# Altium schematic sheet currentV_cond.SchDoc
size A4; SheetNumber: 3; SheetTotal: 12; SPICEModelCacheJNOYGZHY: <root> / <DocumentId>JNOYGZHY</DocumentId> / </root>
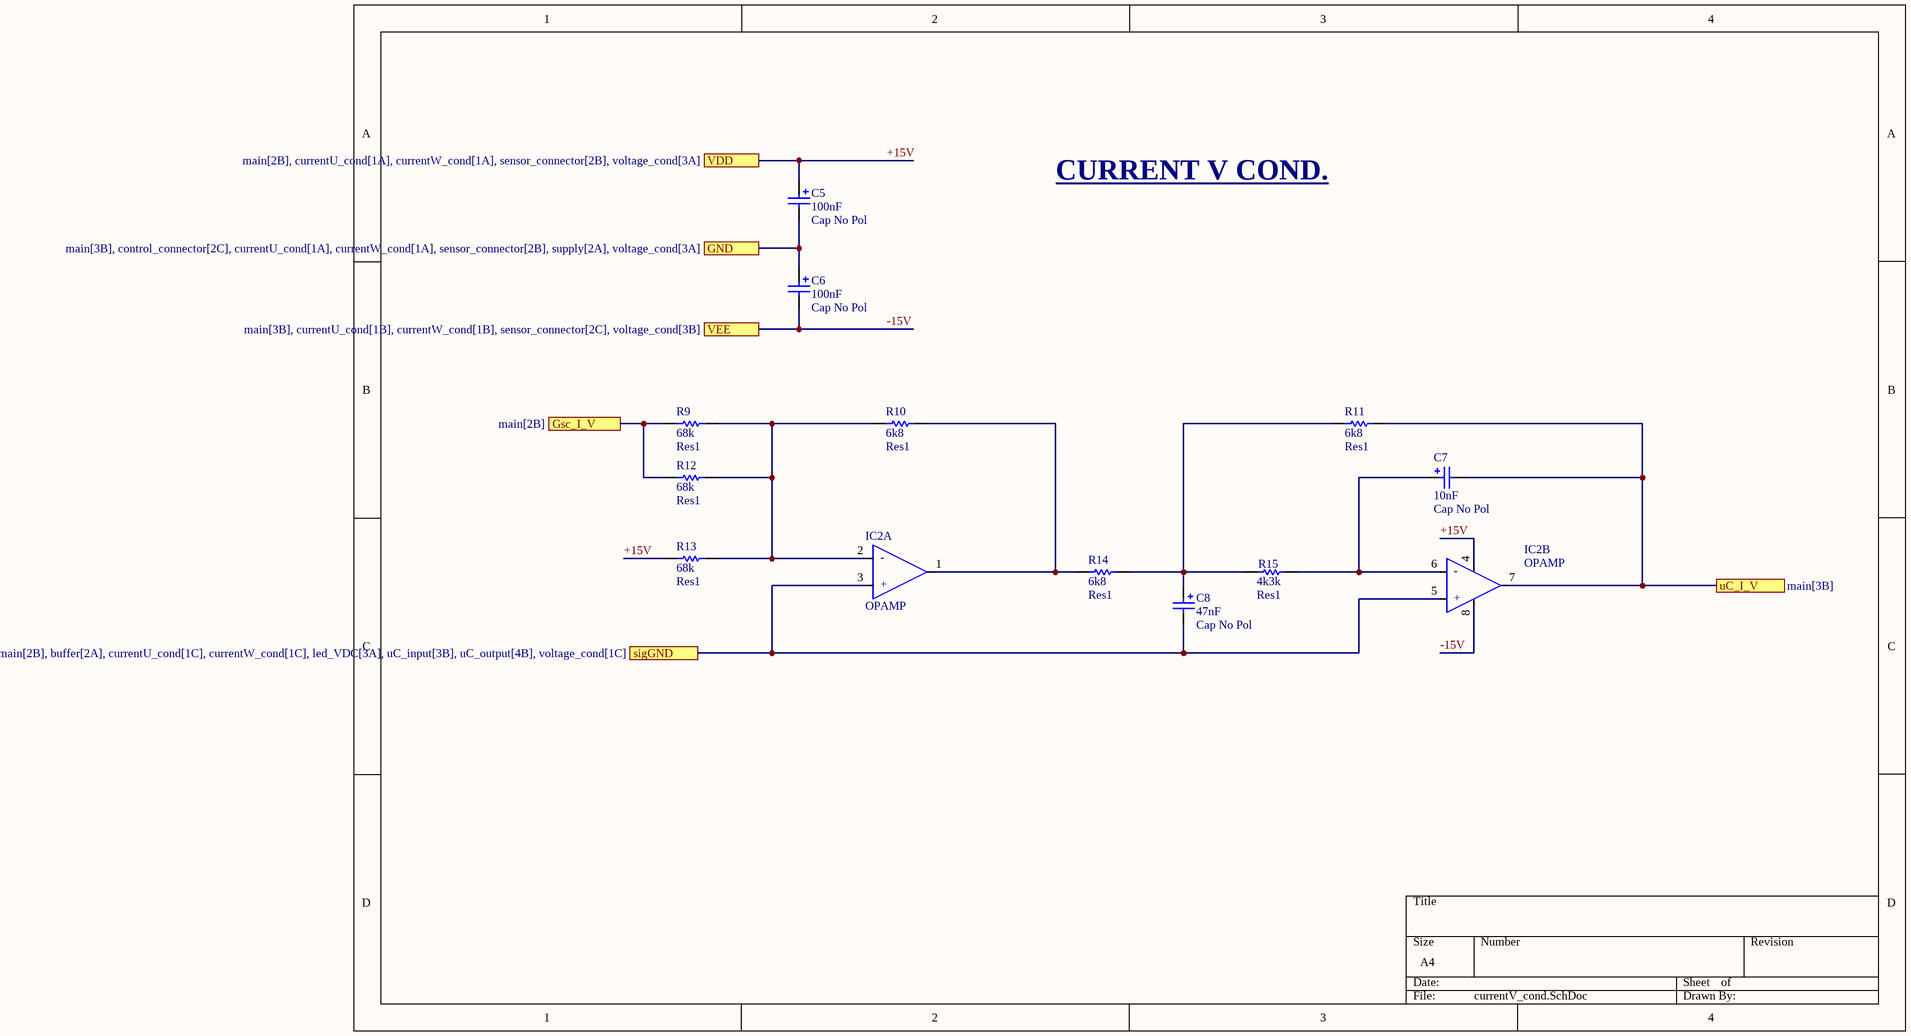
[diagram p0: currentV_cond.SchDoc]

## Parts
C5  Cap No Pol  value 100nF  [RAD-0.1_mod]
C6  Cap No Pol  value 100nF  [RAD-0.1_mod]
C7  Cap No Pol  value 10nF  [RAD-0.1_mod]
C8  Cap No Pol  value 47nF  [RAD-0.1_mod]
IC2  OPAMP  [DIP-8_mod]  (parts A,B of 2)
R9  Res1  value 68k  [AXIAL-0.3_mod]
R10  Res1  value 6k8  [AXIAL-0.3_mod]
R11  Res1  value 6k8  [AXIAL-0.3_mod]
R12  Res1  value 68k  [AXIAL-0.3_mod]
R13  Res1  value 68k  [AXIAL-0.3_mod]
R14  Res1  value 6k8  [AXIAL-0.3_mod]
R15  Res1  value 4k3k  [AXIAL-0.3_mod]

## Ports
GND (see main[3B], control_connector[2C], currentU_cond[1A], currentW_cond[1A], sensor_connector[2B], supply[2A], voltage_cond[3A]), Gsc_I_V (see main[2B]), sigGND (see main[2B], buffer[2A], currentU_cond[1C], currentW_cond[1C], led_VDC[3A], uC_input[3B], uC_output[4B], voltage_cond[1C]), uC_I_V (see main[3B]), VDD (see main[2B], currentU_cond[1A], currentW_cond[1A], sensor_connector[2B], voltage_cond[3A]), VEE (see main[3B], currentU_cond[1B], currentW_cond[1B], sensor_connector[2C], voltage_cond[3B])

## Nets
+15V: C5.1 IC2.4(-V) R13.1 ; port VDD
-15V: C6.2 IC2.8(V+) ; port VEE
GND: C5.2 C6.1 ; port GND
Gsc_I_V: R9.1 R12.1 ; port Gsc_I_V
sigGND: C8.2 IC2.3(IN_A_+) IC2.5(IN_B_+) ; port sigGND
uC_I_V: C7.2 IC2.7(OUT_B) R11.2 ; port uC_I_V
NetC7_1: C7.1 IC2.6(IN_B_-) R15.2
NetC8_1: C8.1 R11.1 R14.2 R15.1
NetIC2_1: IC2.1(OUT_A) R10.2 R14.1
NetIC2_2: IC2.2(IN_A_-) R9.2 R10.1 R12.2 R13.2

## Notes on the sheet
- CURRENT V COND.
- (in symbol ADTL082, part A) -; +
- (in symbol ADTL082, part B) -; +

## Library data of the parts
C5-C8 = Cap No Pol: Polarized Capacitor (Radial); Published: 8-Jun-2000; LatestRevisionDate: 17-Jul-2002; LatestRevisionNote: Re-released for DXP Platform.; PackageReference: RB7.6-15; Publisher: Altium Limited; PackageDescription: Polarized Capacitor (Radial); 2 Leads
IC2 = ADTL082
R9-R15 = Res1: Resistor; Published: 8-Jun-2000; LatestRevisionDate: 17-Jul-2002; LatestRevisionNote: Re-released for DXP Platform.; PackageReference: AXIAL-0.3; Publisher: Altium Limited; PackageDescription: Axial Device, Thru-Hole; 2 Leads; 0.3 in Pin Spacing